# Altium schematic sheet Microcontroller.SchDoc
size A4; SheetNumber: 3; SheetTotal: 4
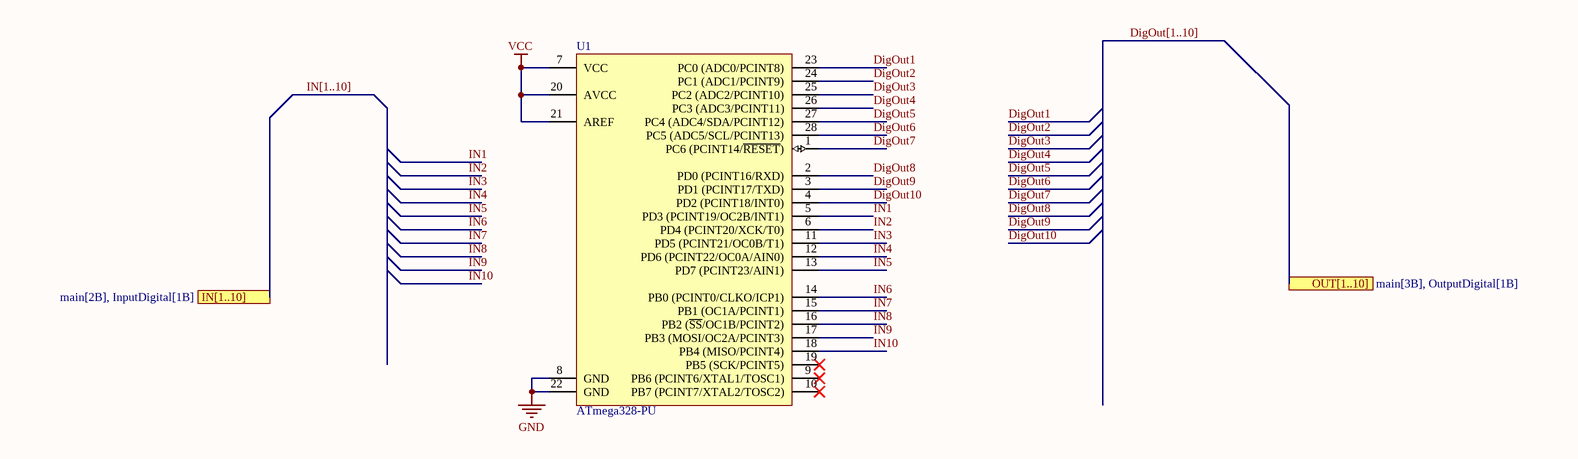
[diagram p0: Microcontroller.SchDoc]

## Parts
U1  ATmega328-PU  [28P3]

## Ports
IN[1..10] (see main[2B], InputDigital[1B]), OUT[1..10] (see main[3B], OutputDigital[1B])

## Nets
GND: U1.8(GND) U1.22(GND)
VCC: U1.7(VCC) U1.20(AVCC) U1.21(AREF)
DigOut1: U1.23(PC0_(ADC0/PCINT8))
DigOut2: U1.24(PC1_(ADC1/PCINT9))
DigOut3: U1.25(PC2_(ADC2/PCINT10))
DigOut4: U1.26(PC3_(ADC3/PCINT11))
DigOut5: U1.27(PC4_(ADC4/SDA/PCINT12))
DigOut6: U1.28(PC5_(ADC5/SCL/PCINT13))
DigOut7: U1.1(PC6_(PCINT14/~{RESET}))
DigOut8: U1.2(PD0_(PCINT16/RXD))
DigOut9: U1.3(PD1_(PCINT17/TXD))
DigOut10: U1.4(PD2_(PCINT18/INT0))
IN1: U1.5(PD3_(PCINT19/OC2B/INT1))
IN2: U1.6(PD4_(PCINT20/XCK/T0))
IN3: U1.11(PD5_(PCINT21/OC0B/T1))
IN4: U1.12(PD6_(PCINT22/OC0A/AIN0))
IN5: U1.13(PD7_(PCINT23/AIN1))
IN6: U1.14(PB0_(PCINT0/CLKO/ICP1))
IN7: U1.15(PB1_(OC1A/PCINT1))
IN8: U1.16(PB2_(~{SS}/OC1B/PCINT2))
IN9: U1.17(PB3_(MOSI/OC2A/PCINT3))
IN10: U1.18(PB4_(MISO/PCINT4))

Not connected (* = marked no-connect by the designer): U1 9(PB6_(PCINT6/XTAL1/TOSC1))* 10(PB7_(PCINT7/XTAL2/TOSC2))* 19(PB5_(SCK/PCINT5))*

## Buses and harness runs
bus DigOut[1..10] = port OUT[1..10]
bus IN[1..10] = port IN[1..10]

## Library data of the parts
U1 = CMP-0095-00015-2: 8-bit AVR Microcontroller, 32KB Flash, 1KB EEPROM, 2KB SRAM, 28-pin PDIP, Industrial Grade (-40°C to 85°C); ComponentLink3Description: ATmega48A/48PA/88A/88PA/168A/168PA/328/328P Summary; RevisionNote: DatasheetVersion updated. URLs added.; DatasheetVersion: revD, May-2011; ComponentLink1URL: http://www.atmel.com/; PackageVersion: revB, Sep-2001; PackageDescription: 28-lead (0.300"/7.62mm Wide) Plastic Dual Inline Package (PDIP); PackageReference: 28P3; ComponentLink1Description: Manufacturer URL; ComponentLink2Description: ATmega48A/48PA/88A/88PA/168A/168PA/328/328P Datasheet; ComponentLink3URL: http://www.atmel.com/dyn/resources/prod_documents/8271S.pdf; ComponentLink2URL: http://www.atmel.com/dyn/resources/prod_documents/8271.pdf